# EAGLE schematic mini-v1.4-for-apc (EAGLE 7.2.0)

## Sheet 1 of 4: Main Microcontroller
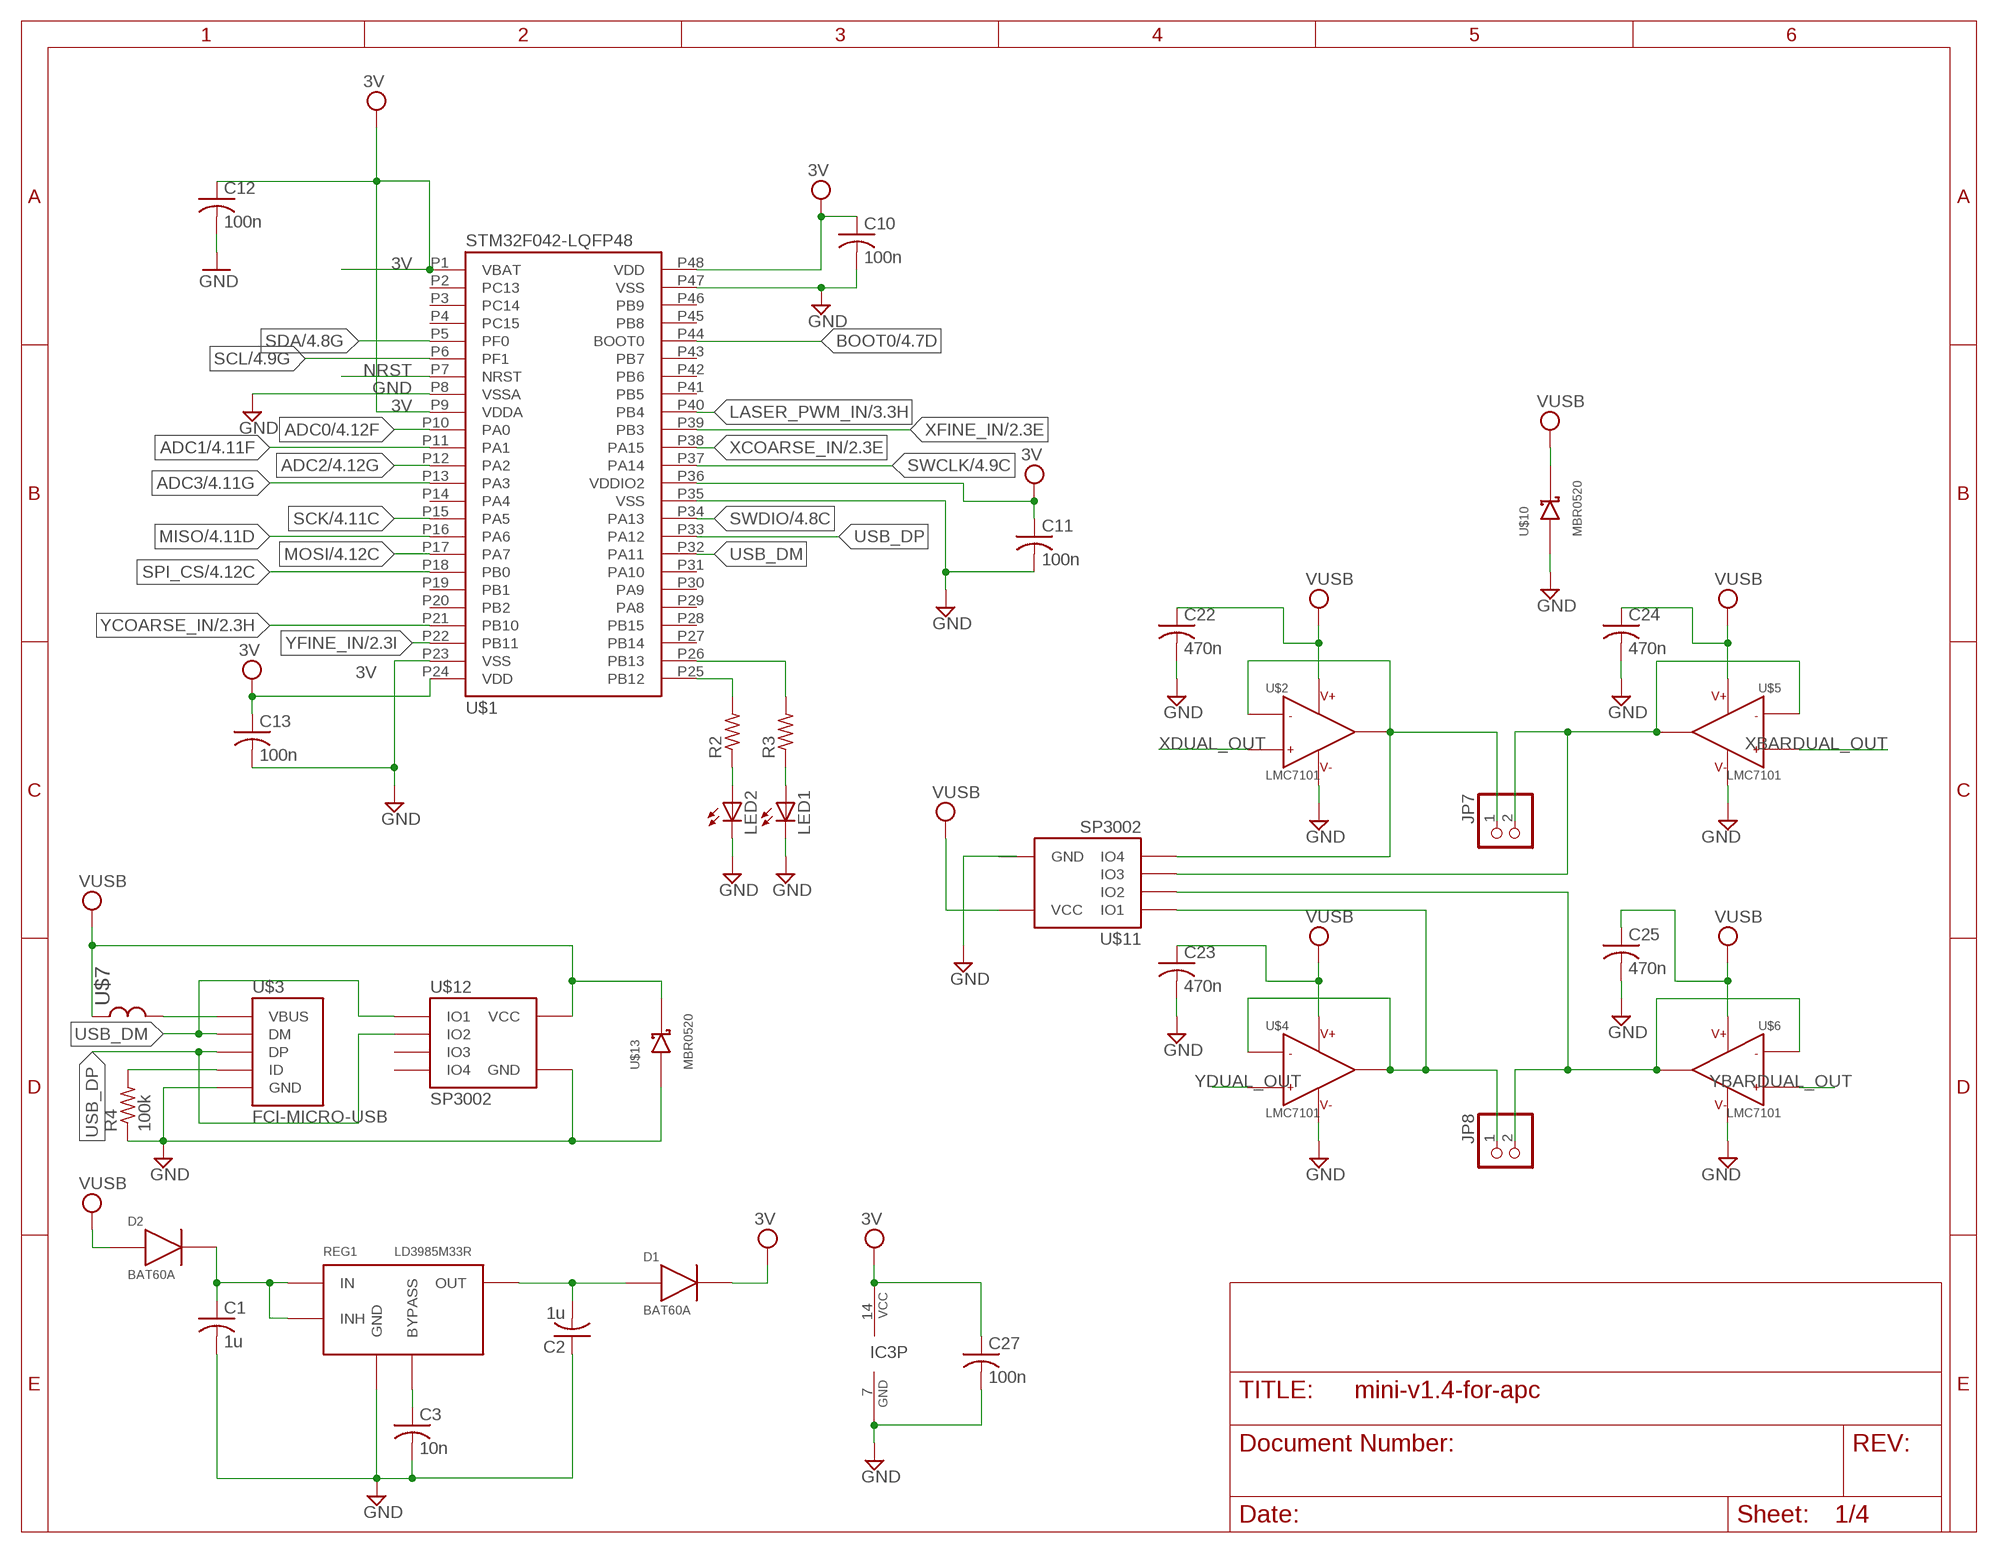
[diagram p0: schematic, sheet 1]

### Parts
C1  1u  C-USC0603  [C0603]
C2  1u  C-USC0603  [C0603]
C3  10n  C-USC0603  [C0603]
C10  100n  C-USC0603  [C0603]
C11  100n  C-USC0603  [C0603]
C12  100n  C-USC0603  [C0603]
C13  100n  C-USC0603  [C0603]
C22  470n  C-USC0603  [C0603]
C23  470n  C-USC0603  [C0603]
C24  470n  C-USC0603  [C0603]
C25  470n  C-USC0603  [C0603]
C27  100n  C-USC0603  [C0603]
D1  BAT60A  [SOD323]
D2  BAT60A  [SOD323]
IC3  74S04D  [SO14]
JP7  PINHD-1X2  [1X02]
JP8  PINHD-1X2  [1X02]
LED1  LEDCHIP-LED0603  [CHIP-LED0603]
LED2  LEDCHIP-LED0603  [CHIP-LED0603]
R2  R-US_R0603  [R0603]
R3  R-US_R0603  [R0603]
R4  100k  R-US_R0603  [R0603]
REG1  LD3985M33R  LD3985MXXR  [SOT23-5L]
U$1  STM32F042-LQFP48  [LQFP48]
U$2  LMC7101  [SOT23-5]
U$3  FCI-MICRO-USB  [FCI-MICROUSB]
U$4  LMC7101  [SOT23-5]
U$5  LMC7101  [SOT23-5]
U$6  LMC7101  [SOT23-5]
U$7  L_TDK_1005  [MLK1005]
U$10  MBR0520  [SOD123]
U$11  SP3002  [SC70-6]
U$12  SP3002  [SC70-6]
U$13  MBR0520  [SOD123]

### Nets
3V: C10.1 C11.1 C12.1 C13.1 C27.1 D1.1 IC3.14(P:VCC) U$1.P1(VBAT) U$1.P9(VDDA) U$1.P24(VDD) U$1.P36(VDDIO2) U$1.P48(VDD) ; also sheet 4
3V3: C2.2 D1.2 REG1.OUT
ADC0: U$1.P10(PA0) ; also sheet 4
ADC1: U$1.P11(PA1) ; also sheet 4
ADC2: U$1.P12(PA2) ; also sheet 4
ADC3: U$1.P13(PA3) ; also sheet 4
BOOT0: U$1.P44(BOOT0) ; also sheet 4
GND [Power]: C1.2 C2.1 C3.2 C10.2 C11.2 C12.2 C13.2 C22.2 C23.2 C24.2 C25.2 C27.2 IC3.7(P:GND) LED1.C LED2.C R4.1 REG1.GND U$1.P8(VSSA) U$1.P23(VSS) U$1.P35(VSS) U$1.P47(VSS) U$2.5 U$3.P5(GND) U$4.5 U$5.5 U$6.5 U$10.ANODE U$12.P2(GND) U$13.ANODE ; also sheet 2,3,4
LASER_PWM_IN: U$1.P40(PB4) ; also sheet 3
MISO: U$1.P16(PA6) ; also sheet 4
MOSI: U$1.P17(PA7) ; also sheet 4
N$1: C3.1 REG1.BYPASS
N$2: R2.2 U$1.P25(PB12)
N$3: LED2.A R2.1
N$4: C1.1 D2.1 REG1.IN REG1.INHIBIT(INH)
N$5: R4.2 U$3.P4(ID)
N$7: JP7.1 U$2.1 U$2.4 U$11.P6(IO4)
N$9: JP8.1 U$4.1 U$4.4 U$11.P1(IO1)
N$12: LED1.A R3.1
N$13: R3.2 U$1.P26(PB13)
N$14: U$3.P1(VBUS) U$7.P$2
N$16: JP7.2 U$5.1 U$5.4 U$11.P4(IO3)
N$17: JP8.2 U$6.1 U$6.4 U$11.P3(IO2)
NRST: U$1.P7(NRST) ; also sheet 4
SCK: U$1.P15(PA5) ; also sheet 4
SCL: U$1.P6(PF1) ; also sheet 4
SDA: U$1.P5(PF0) ; also sheet 4
SPI_CS: U$1.P18(PB0) ; also sheet 4
SWCLK: U$1.P37(PA14) ; also sheet 4
SWDIO: U$1.P34(PA13) ; also sheet 4
USB_DM: U$1.P32(PA11) U$3.P2(DM) U$12.P1(IO1)
USB_DP: U$1.P33(PA12) U$3.P3(DP) U$12.P3(IO2)
VUSB [Power]: C22.1 C23.1 C24.1 C25.1 D2.2 U$2.2 U$4.2 U$5.2 U$6.2 U$7.P$1 U$10.CATHODE U$11.P5(VCC) U$12.P5(VCC) U$13.CATHODE ; also sheet 3
XBARDUAL_OUT: U$5.3 ; also sheet 2
XCOARSE_IN: U$1.P38(PA15) ; also sheet 2
XDUAL_OUT: U$2.3 ; also sheet 2
XFINE_IN: U$1.P39(PB3) ; also sheet 2
YBARDUAL_OUT: U$6.3 ; also sheet 2
YCOARSE_IN: U$1.P21(PB10) ; also sheet 2
YDUAL_OUT: U$4.3 ; also sheet 2
YFINE_IN: U$1.P22(PB11) ; also sheet 2
Unconnected: IC3.1(A:I) IC3.2(A:O) IC3.3(B:I) IC3.4(B:O) U$1.P2(PC13) U$1.P3(PC14) U$1.P4(PC15) U$1.P14(PA4) U$1.P19(PB1) U$1.P20(PB2) U$1.P27(PB14) U$1.P28(PB15) U$1.P29(PA8) U$1.P30(PA9) U$1.P31(PA10) U$1.P41(PB5) U$1.P42(PB6) U$1.P43(PB7) U$1.P45(PB8) U$1.P46(PB9) U$12.P4(IO3) U$12.P6(IO4)

## Sheet 2 of 4: Dual PWM
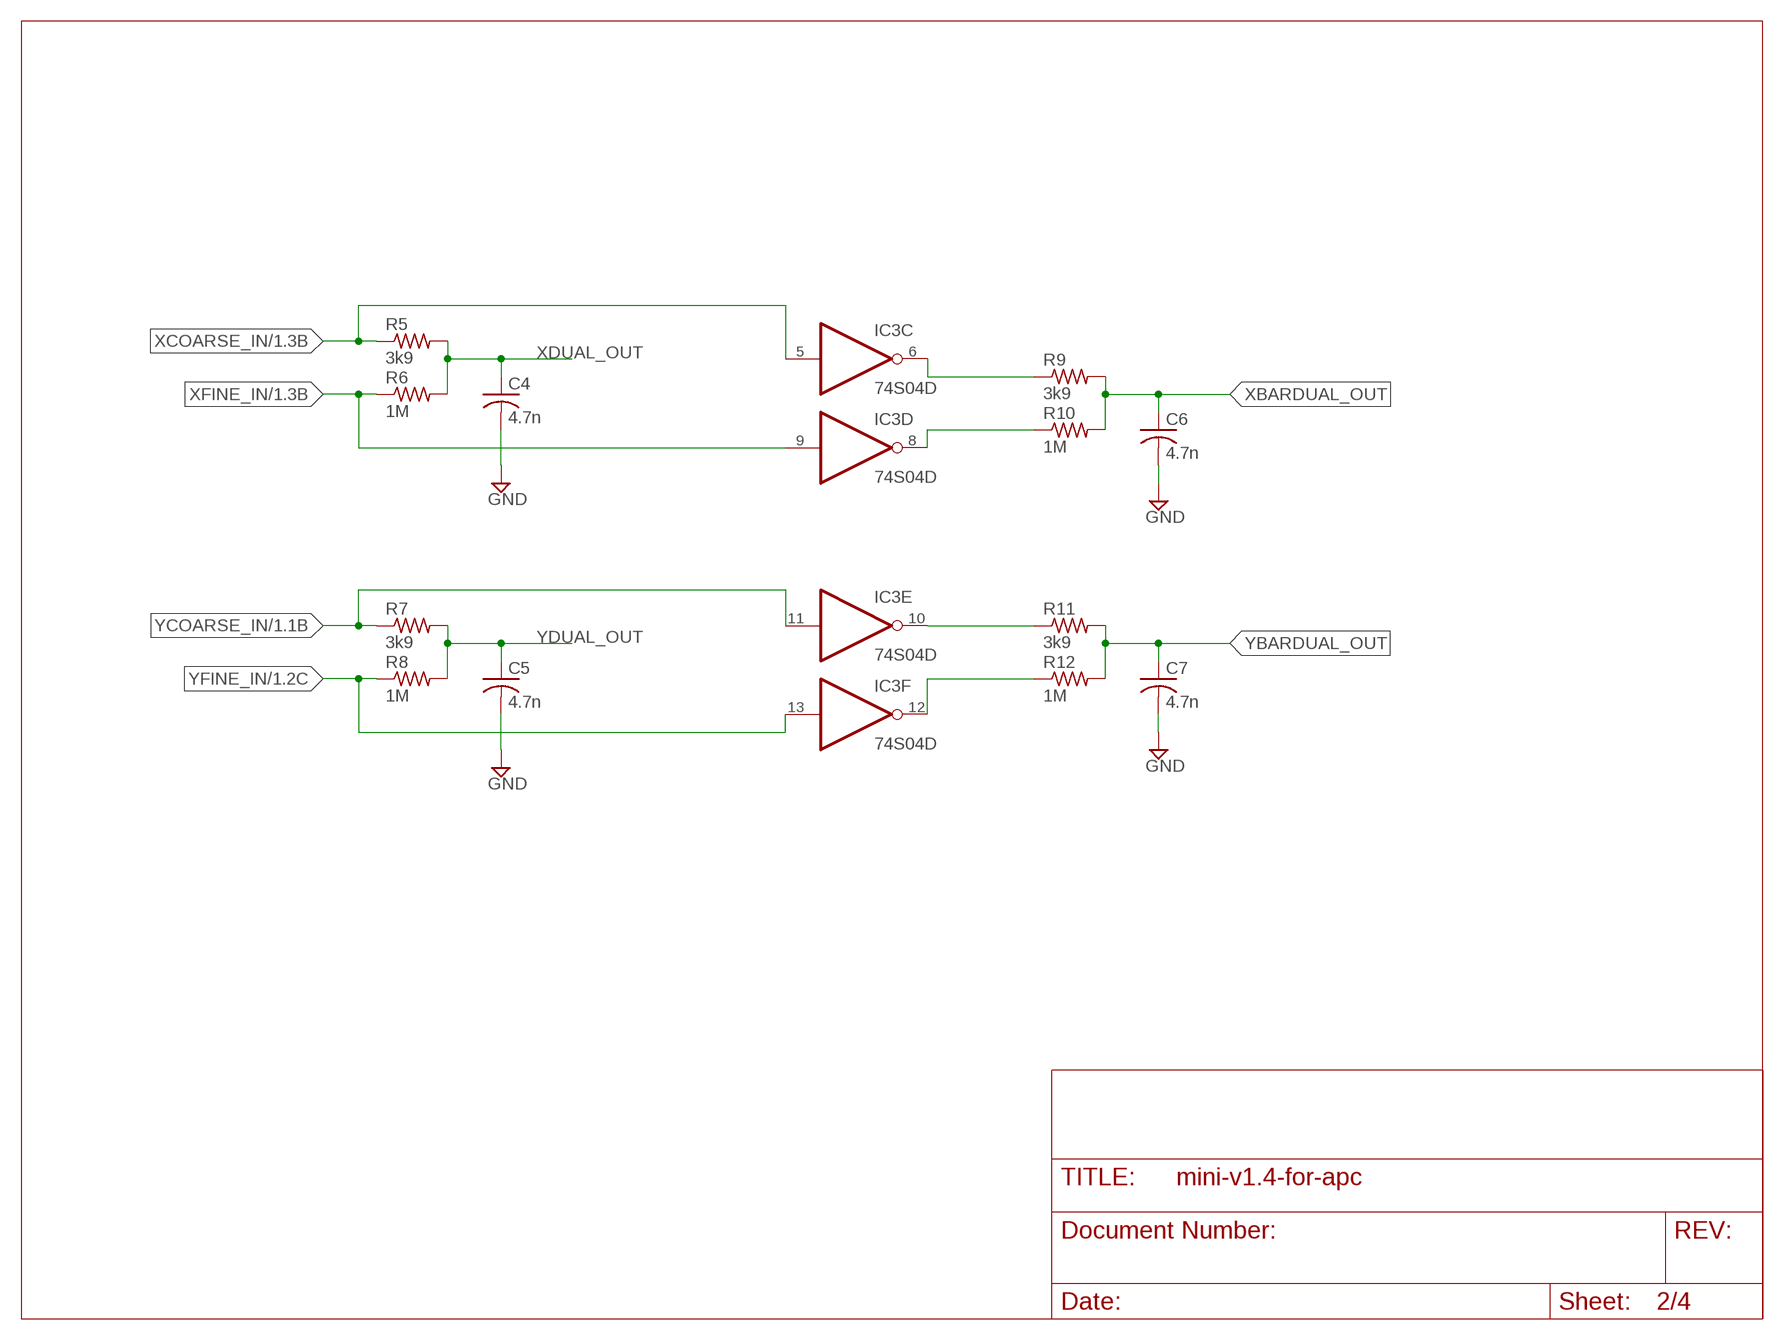
[diagram p1: schematic, sheet 2]

### Parts
C4  4.7n  C-USC0603  [C0603]
C5  4.7n  C-USC0603  [C0603]
C6  4.7n  C-USC0603  [C0603]
C7  4.7n  C-USC0603  [C0603]
R5  3k9  R-US_R0603  [R0603]
R6  1M  R-US_R0603  [R0603]
R7  3k9  R-US_R0603  [R0603]
R8  1M  R-US_R0603  [R0603]
R9  3k9  R-US_R0603  [R0603]
R10  1M  R-US_R0603  [R0603]
R11  3k9  R-US_R0603  [R0603]
R12  1M  R-US_R0603  [R0603]

### Nets
GND [Power]: C4.2 C5.2 C6.2 C7.2 ; also sheet 1,3,4
N$6: IC3.10(E:O) R11.1
N$8: IC3.12(F:O) R12.1
N$10: IC3.8(D:O) R10.1
N$11: IC3.6(C:O) R9.1
XBARDUAL_OUT: C6.1 R9.2 R10.2 ; also sheet 1
XCOARSE_IN: IC3.5(C:I) R5.1 ; also sheet 1
XDUAL_OUT: C4.1 R5.2 R6.2 ; also sheet 1
XFINE_IN: IC3.9(D:I) R6.1 ; also sheet 1
YBARDUAL_OUT: C7.1 R11.2 R12.2 ; also sheet 1
YCOARSE_IN: IC3.11(E:I) R7.1 ; also sheet 1
YDUAL_OUT: C5.1 R7.2 R8.2 ; also sheet 1
YFINE_IN: IC3.13(F:I) R8.1 ; also sheet 1

## Sheet 3 of 4: Laser Power Driver
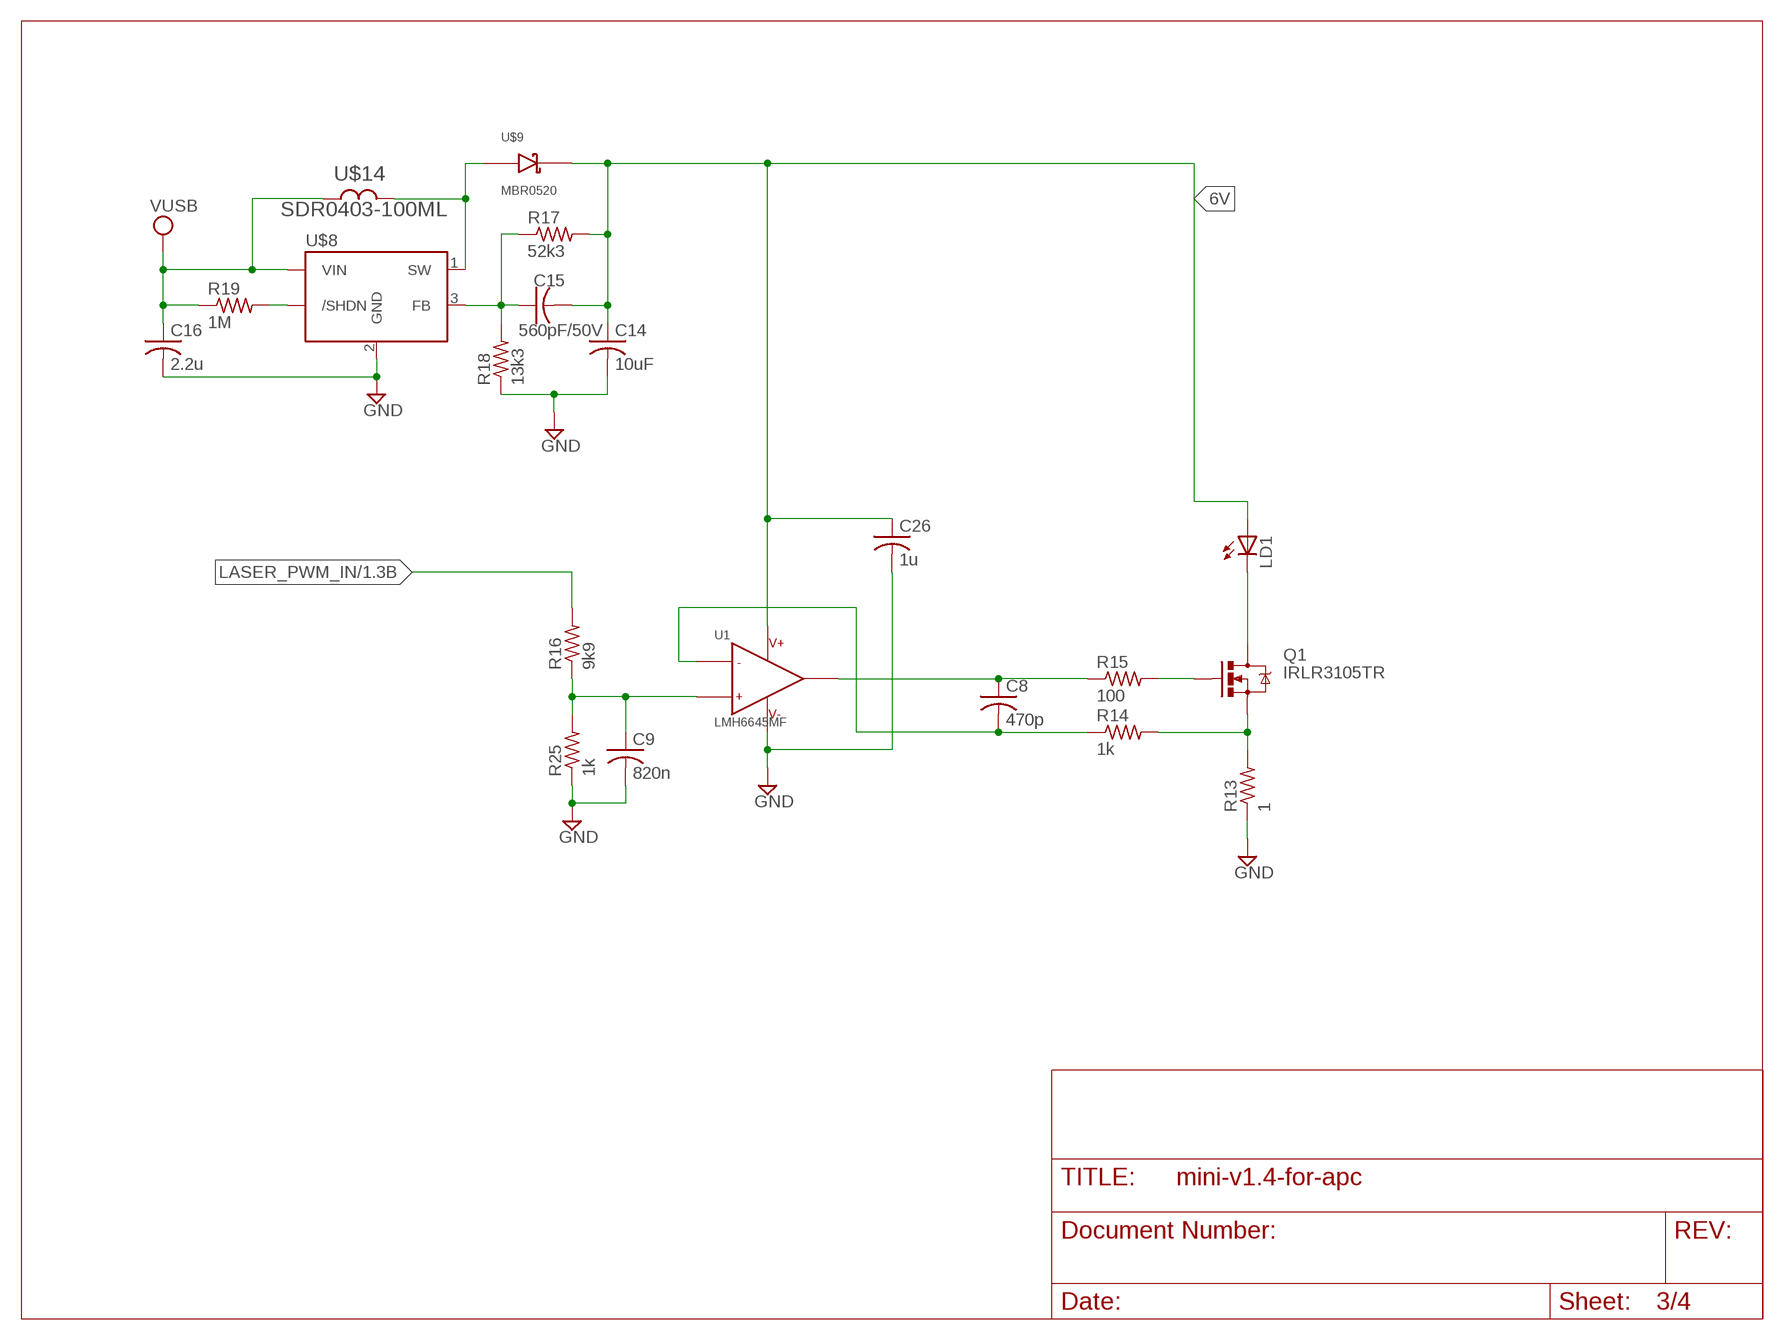
[diagram p2: schematic, sheet 3]

### Parts
C8  470p  C-USC0603  [C0603]
C9  820n  C-USC0603  [C0603]
C14  10uF  C-USC0603  [C0603]
C15  560pF/50V  C-USC0603  [C0603]
C16  2.2u  C-USC0603  [C0603]
C26  1u  C-USC0603  [C0603]
LD1  LASERDIODELD2  [LASERDIODE2]
Q1  IRLR3105TR  FET-N-IRLR3105TRIRLR3105TR  [DPAK]
R13  1  R-US_R0603  [R0603]
R14  1k  R-US_R0603  [R0603]
R15  100  R-US_R0603  [R0603]
R16  9k9  R-US_R0603  [R0603]
R17  52k3  R-US_R0603  [R0603]
R18  13k3  R-US_R0603  [R0603]
R19  1M  R-US_R0603  [R0603]
R25  1k  R-US_R0603  [R0603]
U1  LMH6645MF  OPAMP-SINGLELMH6645MF  [SOT23-5]
U$8  LMR62014  [SOT23-5]
U$9  MBR0520  [SOD123]
U$14  SDR0403-100ML  SDR0403  [SDR0403]

### Nets
6V [Power]: C14.1 C15.2 C26.1 LD1.P$1(A) R17.2 U1.5(V+) U$9.CATHODE
GND [Power]: C9.2 C14.2 C16.2 C26.2 R13.1 R18.1 R25.1 U1.2(V-) U$8.2(GND) ; also sheet 1,2,4
LASER_PWM_IN: R16.2 ; also sheet 1
N$15: U$8.1(SW) U$9.ANODE U$14.P$2
N$18: LD1.P$3(C) Q1.4(D)
N$19: Q1.3(S) R13.2 R14.2
N$20: C8.2 R14.1 U1.4(IN-)
N$21: Q1.1(G) R15.2
N$22: C8.1 R15.1 U1.1(OUT)
N$23: C9.1 R16.1 R25.2 U1.3(IN+)
N$25: C15.1 R17.1 R18.2 U$8.3(FB)
N$26: R19.2 U$8.4(/SHDN)
VUSB [Power]: C16.1 R19.1 U$8.5(VIN) U$14.P$1 ; also sheet 1

## Sheet 4 of 4
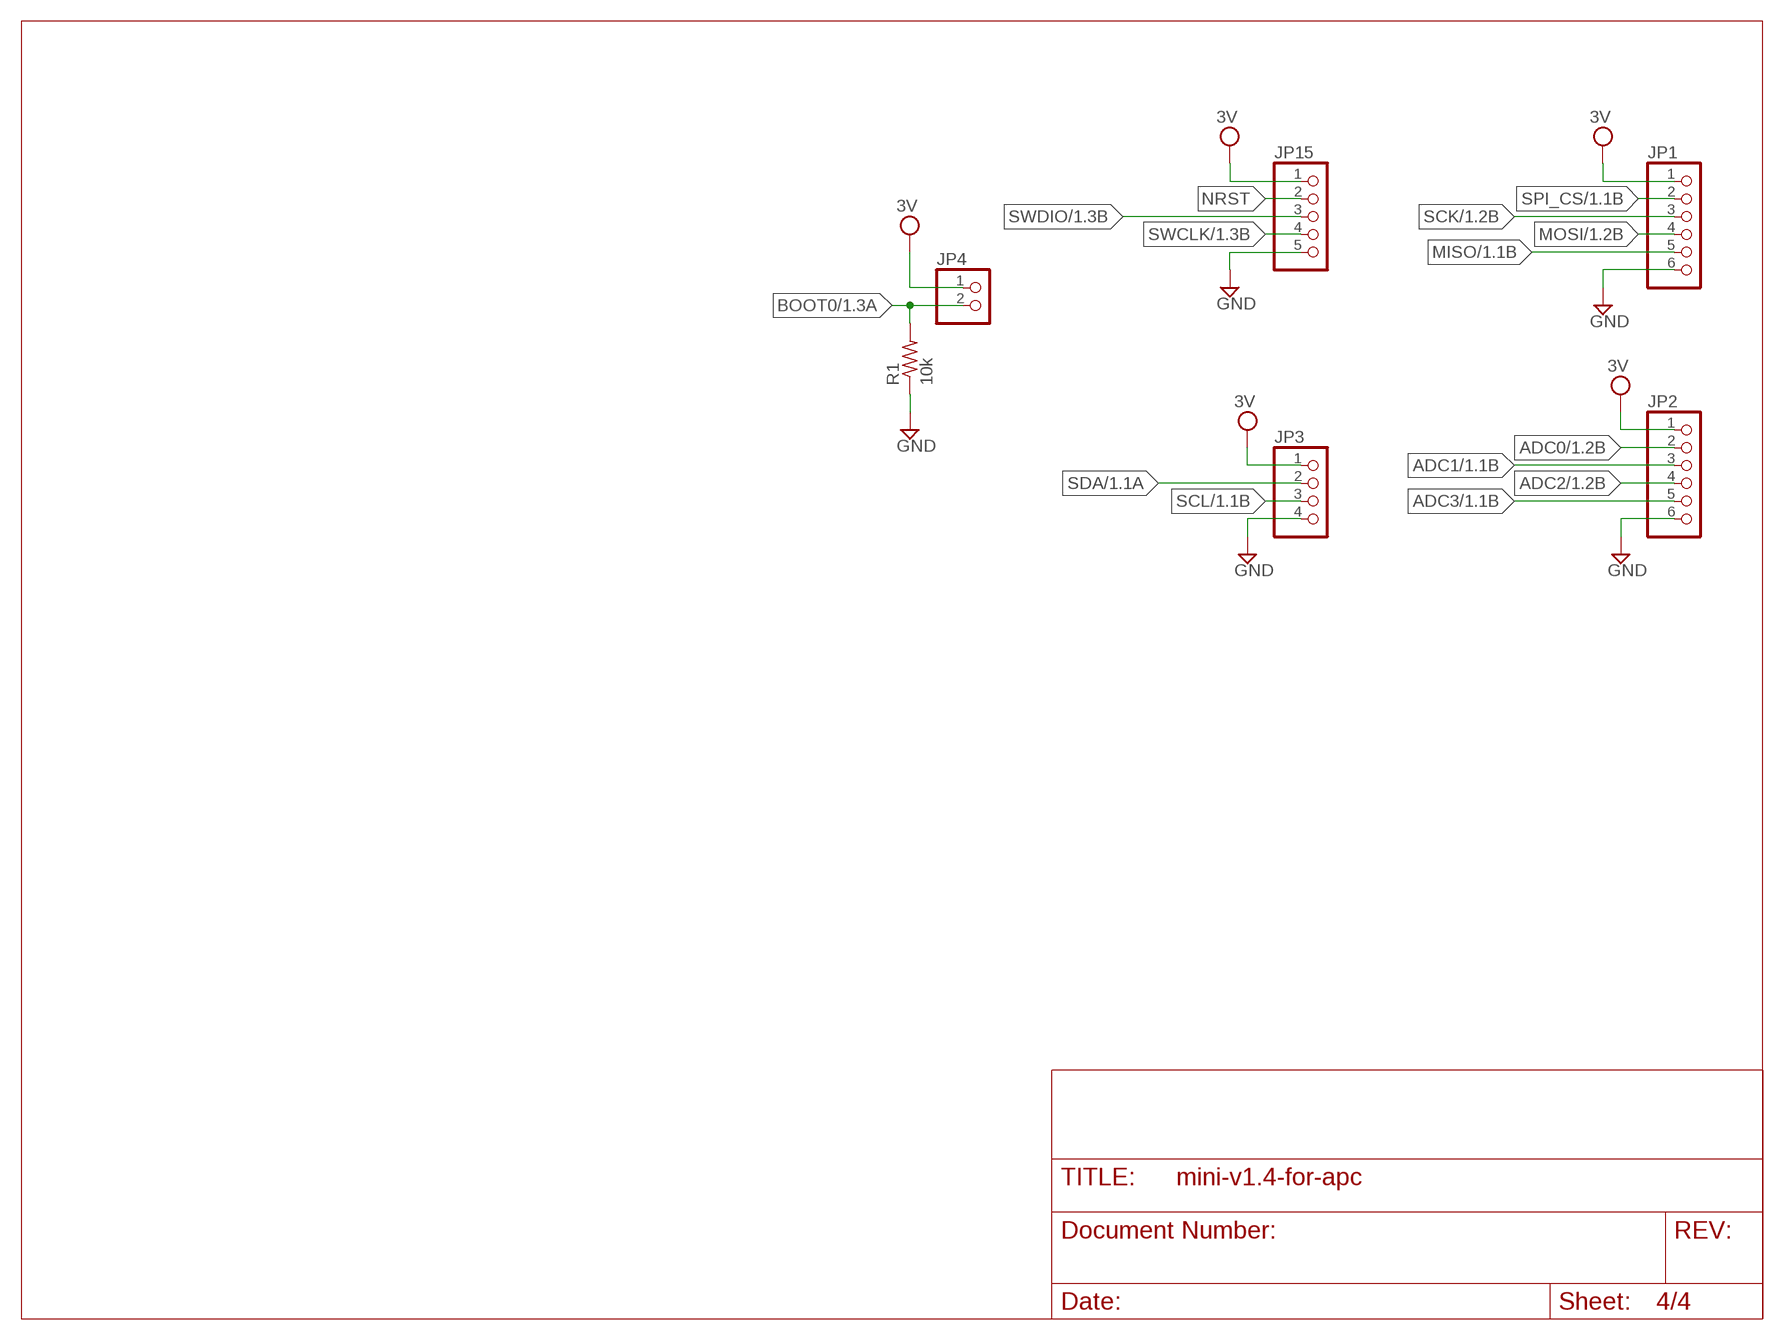
[diagram p3: schematic, sheet 4]

### Parts
JP1  PINHD-1X6  [1X06]
JP2  PINHD-1X6  [1X06]
JP3  PINHD-1X4  [1X04]
JP4  PINHD-1X2  [1X02]
JP15  PINHD-1X5  [1X05]
R1  10k  R-US_R0603  [R0603]

### Nets
3V: JP1.1 JP2.1 JP3.1 JP4.1 JP15.1 ; also sheet 1
ADC0: JP2.2 ; also sheet 1
ADC1: JP2.3 ; also sheet 1
ADC2: JP2.4 ; also sheet 1
ADC3: JP2.5 ; also sheet 1
BOOT0: JP4.2 R1.2 ; also sheet 1
GND [Power]: JP1.6 JP2.6 JP3.4 JP15.5 R1.1 ; also sheet 1,2,3
MISO: JP1.5 ; also sheet 1
MOSI: JP1.4 ; also sheet 1
NRST: JP15.2 ; also sheet 1
SCK: JP1.3 ; also sheet 1
SCL: JP3.3 ; also sheet 1
SDA: JP3.2 ; also sheet 1
SPI_CS: JP1.2 ; also sheet 1
SWCLK: JP15.4 ; also sheet 1
SWDIO: JP15.3 ; also sheet 1

## Power pins joined to a net without a drawn wire
GND: U$11.P2(GND)

## Library data of the parts
C1-C16 C22-C27 = rcl:C-US: CAPACITOR, American symbol
D1 D2 = lmdparts:BAT60A
IC3 = lmdparts:74*04: Hex INVERTER
JP1 JP2 = pinhead:PINHD-1X6: PIN HEADER
JP3 = pinhead:PINHD-1X4: PIN HEADER
JP4 JP7 JP8 = pinhead:PINHD-1X2: PIN HEADER
JP15 = pinhead:PINHD-1X5: PIN HEADER
LD1 = Scott:LASERDIODE; MPN: 3 x (0552-2-15-15-11-27-10-0)
LED1 LED2 = adafruit:LED: LED OSRAM: - CHIPLED LG R971, LG N971, LY N971, LG Q971, LY Q971, LO R971, LY R971 LH N974, LH R974 LS Q976, LO Q976, LY Q976 LO Q996 - Hyper CHIPLED LW Q18S LB Q993, LB Q99A, LB R99A - SideLED LS A670, LO A670, LY A670, LG A670, LP A670 LB A673, LV A673, LT A673, LW A673 LH A674 LY A675 LS A676, LA A676, LO A676, LY A676, LW A676 LS A679, LY A679, LG A679 - Hyper Micro SIDELED® LS Y876, LA Y876, LO Y876, LY Y876 LT Y87S - SmartLED LW L88C, LW L88S LB L89C, LB L89S, LG L890 LS L89K, LO L89K, LY L89K LS L896, LA L896, LO L896, LY L896 - TOPLED LS T670, LO T670, LY T670, LG T670, LP T670 LSG T670, LSP T670, LSY T670, LOP T670, LYG T670 LG T671, LOG T671, LSG T671 LB T673, LV T673, LT T673, LW T673 LH T674 LS T676, LA T676, LO T676, LY T676, LB T676, LH T676, LSB T676, LW T676 LB T67C, LV T67C, LT T67C, LS T67K, LO T67K, LY T67K, LW E67C LS E67B, LA E67B, LO E67B, LY E67B, LB E67C, LV E67C, LT E67C LW T67C LS T679, LY T679, LG T679 LS T770, LO T770, LY T770, LG T770, LP T770 LB T773, LV T773, LT T773, LW T773 LH T774 LS E675, LA E675, LY E675, LS T675 LS T776, LA T776, LO T776, LY T776, LB T776 LHGB T686 LT T68C, LB T68C - Hyper Mini TOPLED® LB M676 - Mini TOPLED Santana® LG M470 LS M47K, LO M47K, LY M47K Source: http://www.osram.convergy.de/
Q1 = lmdparts:FET-N-IRLR3105TR: Common NMOSFET Parts MFG P/N Store ID Prod ID FDD8780 TRANS-09984 SI7820DN TRANS-11055 FDS6630A IC-08089 2N7002PW TRANS-11151 FQP30N06L COM-10213 TRANS-10060 BSS123LT1G TRANS-08345 BSS138 TRANS-00830 BS170 2N7000; PROD_ID: TRANS-09984
R1-R19 R25 = rcl:R-US_: RESISTOR, American symbol
REG1 = lmdparts:LD3985MXXR
U1 = lmdparts:OPAMP-SINGLE: Single amp opamps
U$1 = lmdparts:STM32F042-LQFP48
U$2 U$4-U$6 = lmdparts:LMC7101
U$3 = lmdparts:FCI-MICRO-USB
U$7 = lmdparts:L_TDK_1005
U$8 = lmdparts:LMR62014
U$9 U$10 U$13 = lmdparts:MBR0520
U$11 U$12 = lmdparts:SP3002
U$14 = lmdparts:SDR0403

## Net classes
1 Power: width 0.305 mm